# EAGLE schematic InverterControl (EAGLE 9.6.2)
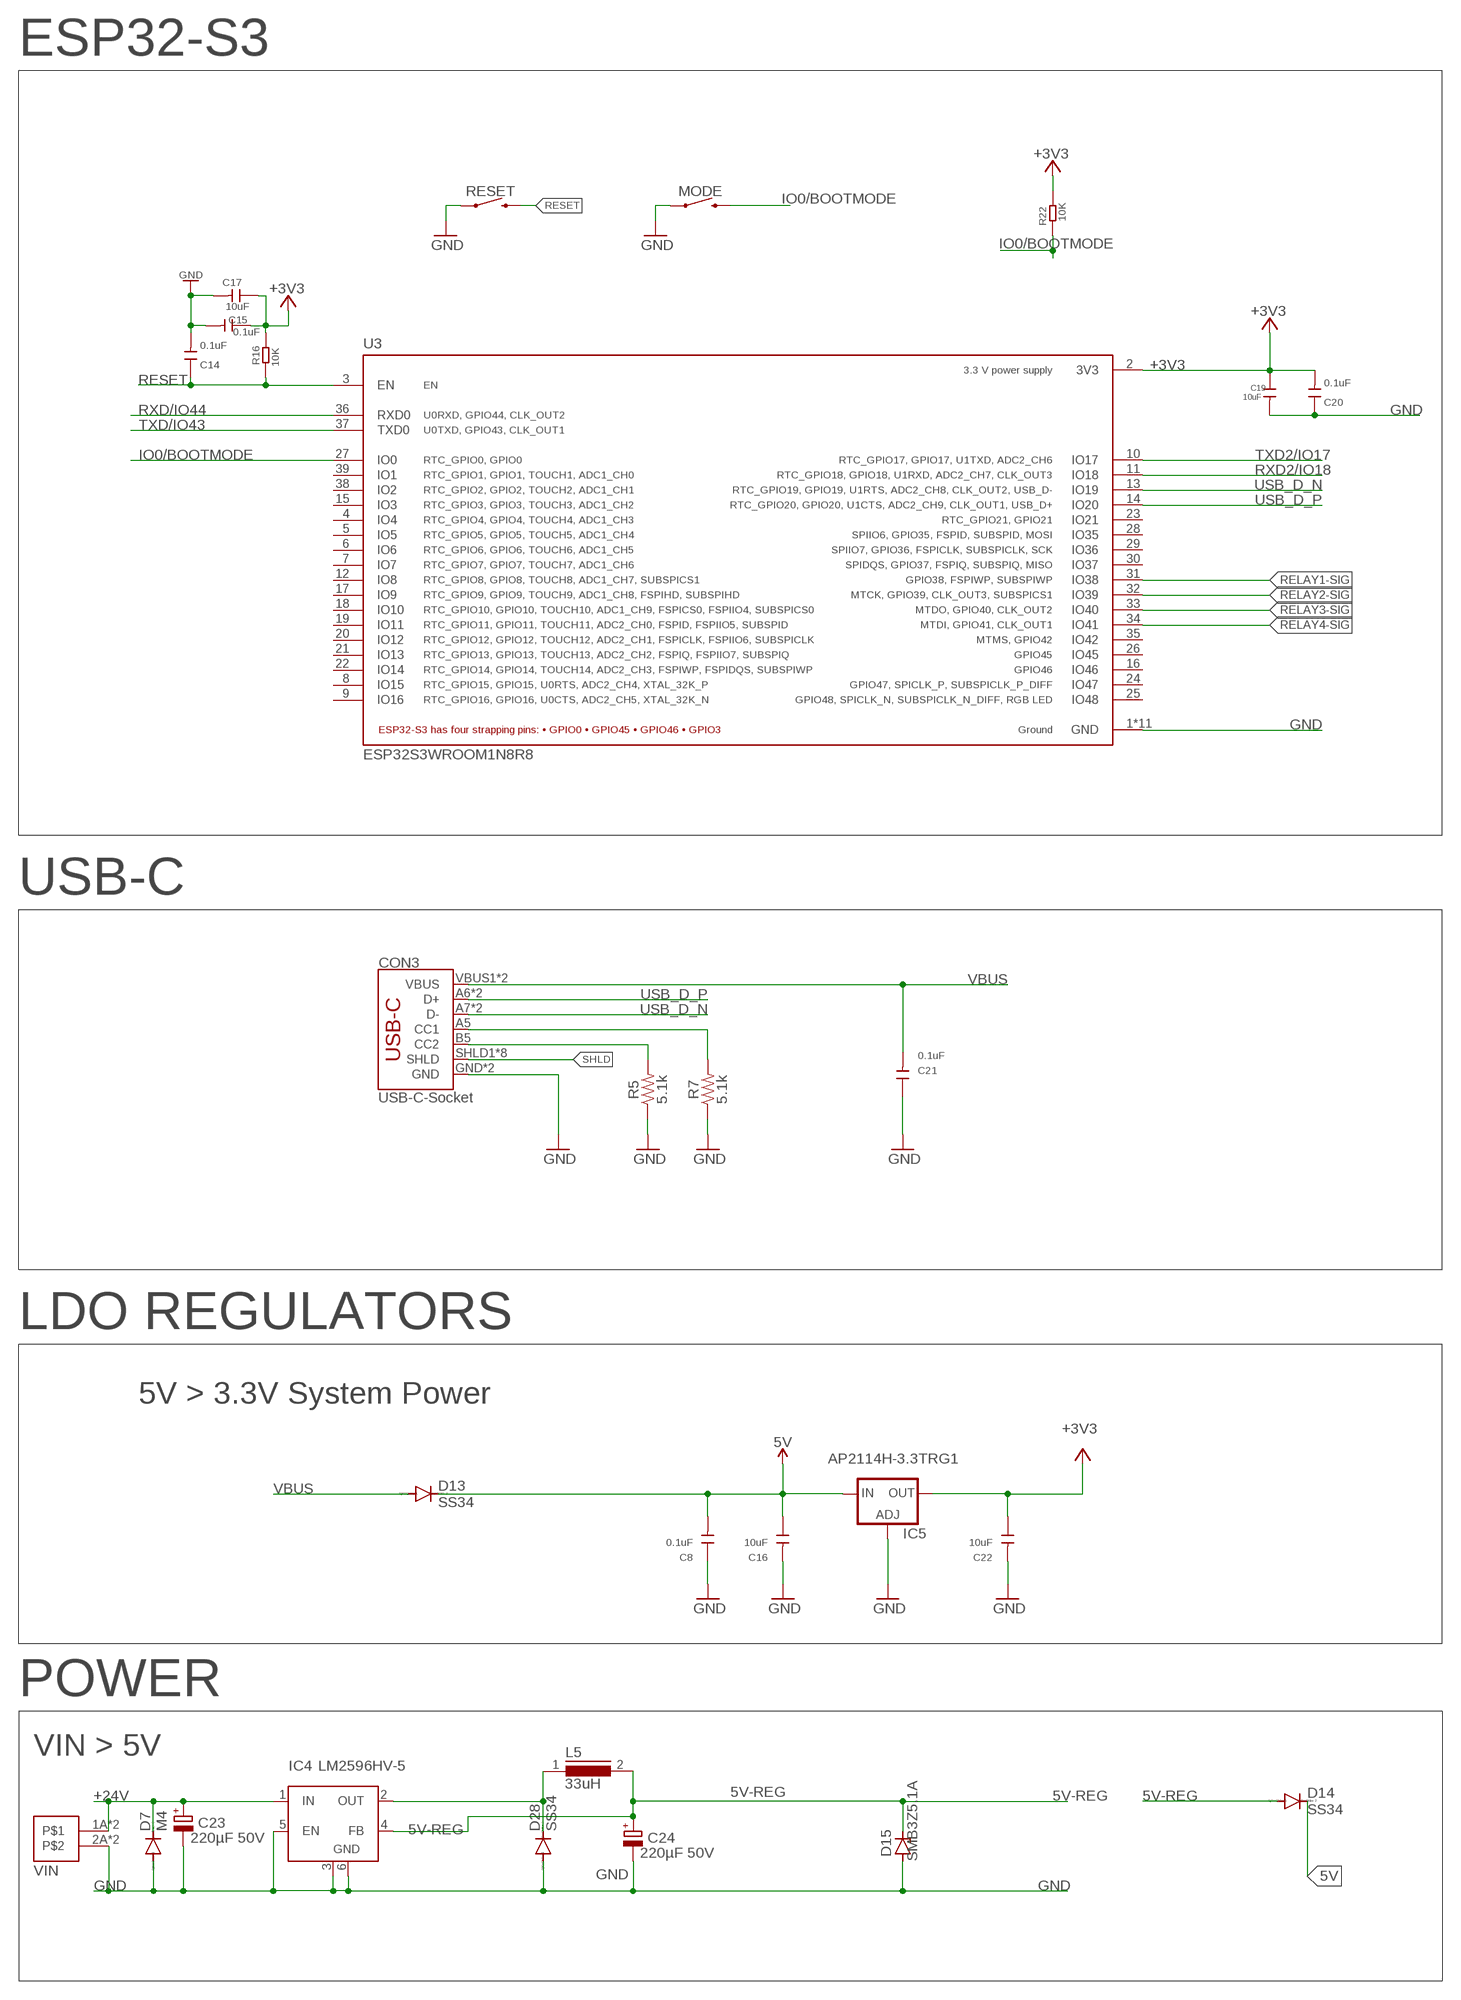
[diagram p0: schematic, sheet 1, part 1 of 2]
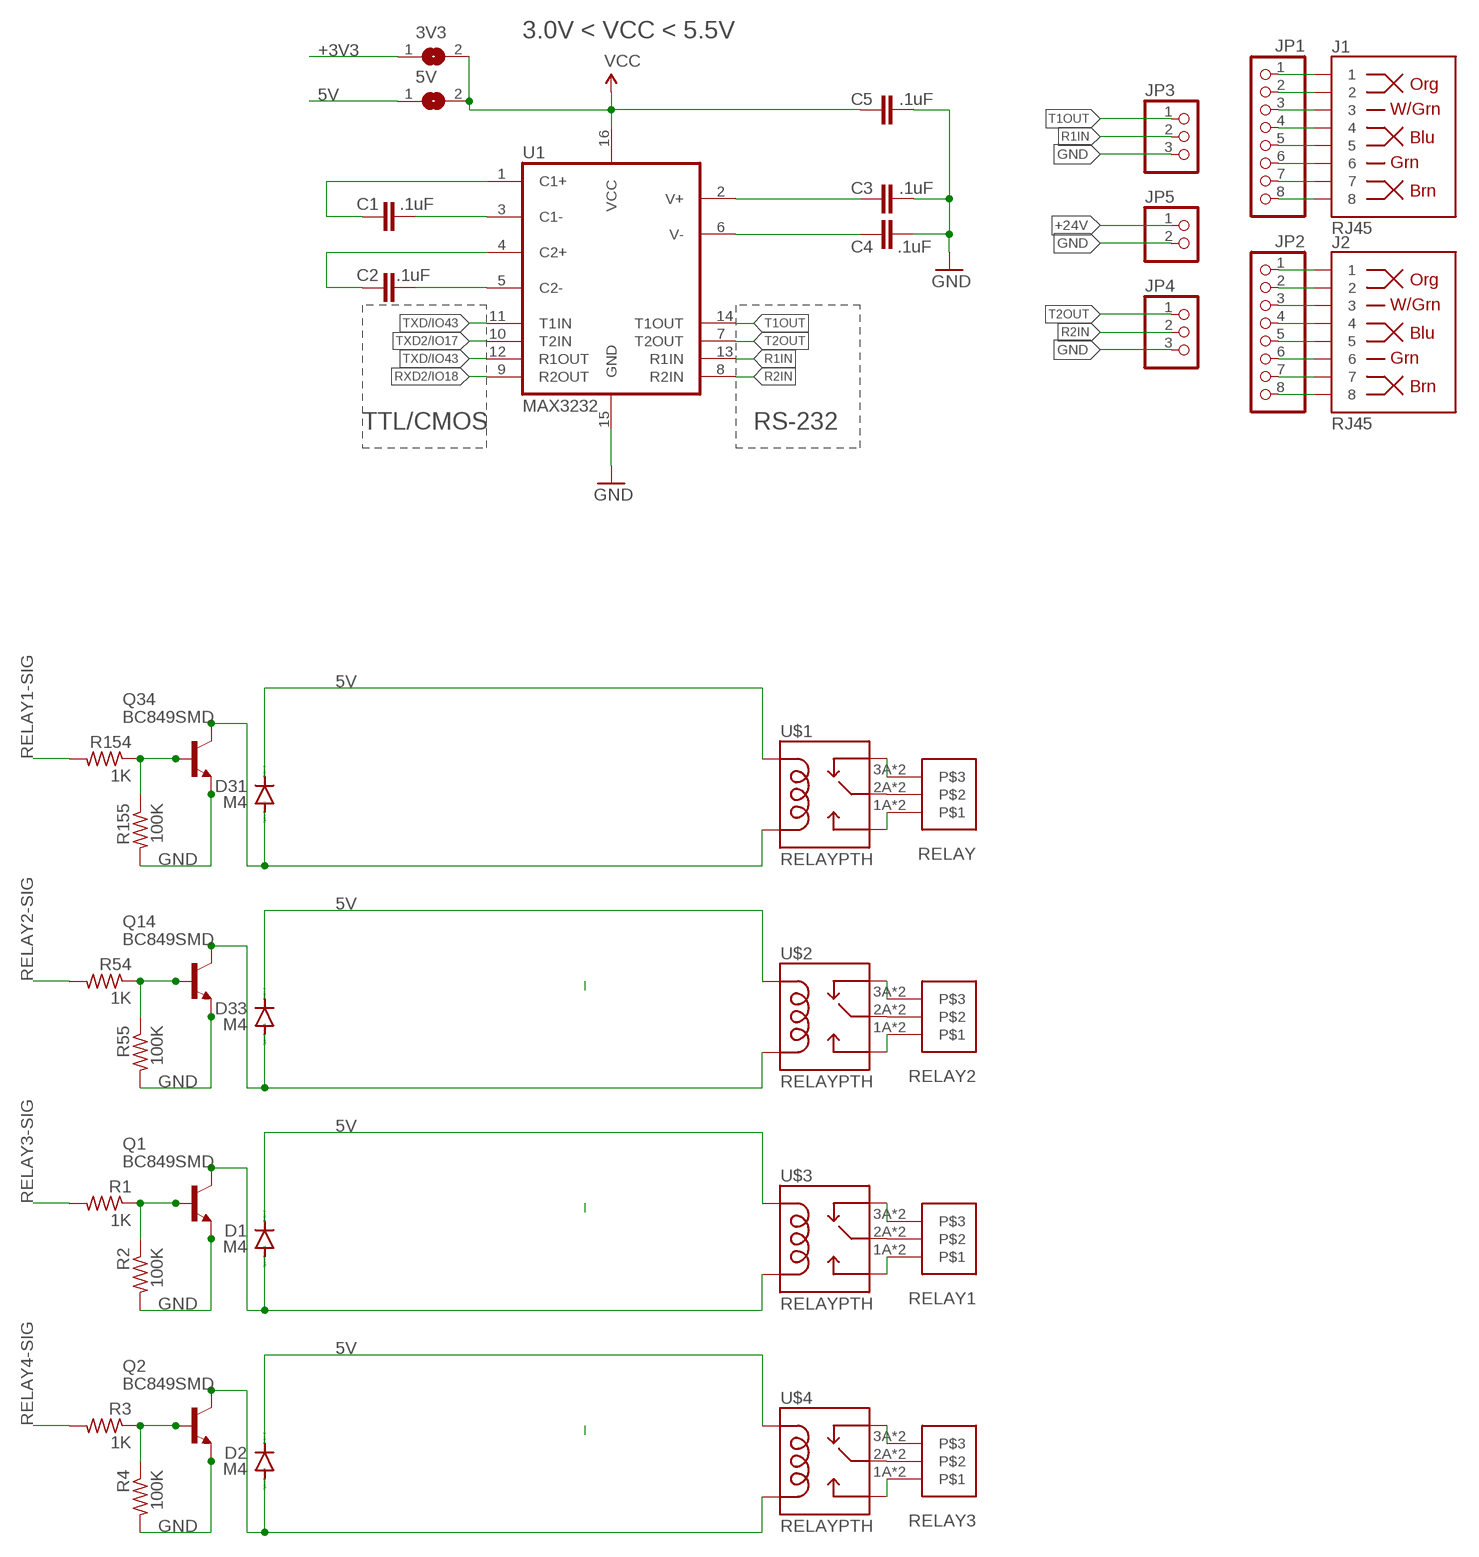
[diagram p1: schematic, sheet 1, part 2 of 2]

## Parts
3V3  SJ  [SJ]
5V  SJ  [SJ]
C1  .1uF  0.1UF-25V(+80/-20%)(0603)  [0603-CAP]
C2  .1uF  0.1UF-25V(+80/-20%)(0603)  [0603-CAP]
C3  .1uF  0.1UF-25V(+80/-20%)(0603)  [0603-CAP]
C4  .1uF  0.1UF-25V(+80/-20%)(0603)  [0603-CAP]
C5  .1uF  0.1UF-25V(+80/-20%)(0603)  [0603-CAP]
C8  0.1uF  DISCRETE_C-1206  [DISCRETE_C1206]
C14  0.1uF  DISCRETE_C-1206  [DISCRETE_C1206]
C15  0.1uF  DISCRETE_C-1206  [DISCRETE_C1206]
C16  10uF  C-1206  [C1206]
C17  10uF  DISCRETE_C-1206  [DISCRETE_C1206]
C19  10uF  C-1206  [C1206]
C20  0.1uF  DISCRETE_C-1206  [DISCRETE_C1206]
C21  0.1uF  DISCRETE_C-1206  [DISCRETE_C1206]
C22  10uF  C-1206  [C1206]
C23  220µF 50V  CPOL-EUE  [PANASONIC_E]
C24  220µF 50V  CPOL-EUE  [PANASONIC_E]
CON3  USB-C-Socket  USB_C16PIN  [USB-C-16P]
D1  M4  DIODE-DO-214AC  [DO-214AC]
D2  M4  DIODE-DO-214AC  [DO-214AC]
D7  M4  DIODE-DO-214AC  [DO-214AC]
D13  SS34  DIODE-DO-214AC  [DO-214AC]
D14  SS34  DIODE-SMB  [SMB]
D15  SMB3Z5.1A  ZENER-DIODESMB  [SMB]
D28  SS34  DIODE-SMB  [SMB]
D31  M4  DIODE-DO-214AC  [DO-214AC]
D33  M4  DIODE-DO-214AC  [DO-214AC]
IC4  LM2596HV-5  LM2596S  [TO263-5]
IC5  AP2114H-3.3TRG1  LD117AS33TR  [SOT223]
J1  RJ45  RJ45-8  [RJ45-8]
J2  RJ45  RJ45-8  [RJ45-8]
JP1  PINHD-1X8  [1X08]
JP2  PINHD-1X8  [1X08]
JP3  PINHD-1X3  [1X03]
JP4  PINHD-1X3  [1X03]
JP5  PINHD-1X2  [1X02]
L5  33uH  DR127  [DR127]
MODE  MOMENTARY-SWITCH-SPST-PTH-6.0MM  [TACTILE_SWITCH_PTH_6.0MM]
Q1  BC849SMD  [SOT23-BEC]
Q2  BC849SMD  [SOT23-BEC]
Q14  BC849SMD  [SOT23-BEC]
Q34  BC849SMD  [SOT23-BEC]
R1  1K  R-US_R1206  [R1206]
R2  100K  R-US_R1206  [R1206]
R3  1K  R-US_R1206  [R1206]
R4  100K  R-US_R1206  [R1206]
R5  5.1k  5.1KOHM5.1KOHM-0603-1/10W-1%  [0603@1]
R7  5.1k  5.1KOHM5.1KOHM-0603-1/10W-1%  [0603@1]
R16  10K  R-1206  [R1206]
R22  10K  R-1206  [R1206]
R54  1K  R-US_R1206  [R1206]
R55  100K  R-US_R1206  [R1206]
R154  1K  R-US_R1206  [R1206]
R155  100K  R-US_R1206  [R1206]
RELAY  WJ212R-THR-3.5-3  [WJ212R-THR-3.5-3]
RELAY1  WJ212R-THR-3.5-3  [WJ212R-THR-3.5-3]
RELAY2  WJ212R-THR-3.5-3  [WJ212R-THR-3.5-3]
RELAY3  WJ212R-THR-3.5-3  [WJ212R-THR-3.5-3]
RESET  MOMENTARY-SWITCH-SPST-PTH-6.0MM  [TACTILE_SWITCH_PTH_6.0MM]
U1  MAX3232  MAX232SOIC16  [SO016]
U3  ESP32S3WROOM1N8R8  [XCVR_ESP32S3WROOM1N8R8]
U$1  RELAYPTH  [SRD-05VDC-SL-C]
U$2  RELAYPTH  [SRD-05VDC-SL-C]
U$3  RELAYPTH  [SRD-05VDC-SL-C]
U$4  RELAYPTH  [SRD-05VDC-SL-C]
VIN  WJ212R-THR-3.5-2  [WJ212R-THR-3.5-2]

## Nets
5V: 5V.1 C8.2 C16.1 D1.C D2.C D13.C D14.C D31.C D33.C IC5.3(IN) U$1.COIL1 U$2.COIL1 U$3.COIL1 U$4.COIL1
5V-REG: C24.+ D14.A D15.C IC4.4(FB) L5.2
+3V3: 3V3.1 C15.1 C17.1 C19.1 C20.2 C22.1 IC5.4(OUT) R16.2 R22.2 U3.2(3V3)
+24V: C23.+ D7.C IC4.1(IN) JP5.1 VIN.1A VIN.1B
C1+: C1.1 U1.1(C1+)
C1-: C1.2 U1.3(C1-)
C2+: C2.1 U1.4(C2+)
C2-: C2.2 U1.5(C2-)
CC1: CON3.A5(CC1) R7.2
CC2: CON3.B5(CC2) R5.2
COIL-1: D31.A Q34.C U$1.COIL0
COIL-2: D33.A Q14.C U$2.COIL0
COIL-3: D1.A Q1.C U$3.COIL0
COIL-4: D2.A Q2.C U$4.COIL0
GND: C3.2 C4.2 C5.2 C8.1 C14.2 C15.2 C16.2 C17.2 C19.2 C20.1 C21.1 C22.2 C23.- C24.- CON3.GND CON3.GND2(GND) D7.A D15.A D28.A IC4.3(GND) IC4.5(EN) IC4.6(GND) IC5.1(ADJ) JP3.3 JP4.3 JP5.2 MODE.1 Q1.E Q2.E Q14.E Q34.E R2.2 R4.2 R5.1 R7.1 R55.2 R155.2 RESET.1 U1.15(GND) U3.1(GND) U3.40(GND) U3.41_1(GND) U3.41_2(GND) U3.41_3(GND) U3.41_4(GND) U3.41_5(GND) U3.41_6(GND) U3.41_7(GND) U3.41_8(GND) U3.41_9(GND) VIN.2A VIN.2B
IO0/BOOTMODE: MODE.3 R22.1 U3.27(IO0)
N$1: J1.1 JP1.1
N$2: J1.2 JP1.2
N$3: J1.3 JP1.3
N$4: J1.4 JP1.4
N$5: J1.5 JP1.5
N$6: J1.6 JP1.6
N$7: J1.7 JP1.7
N$8: J1.8 JP1.8
N$9: J2.1 JP2.1
N$10: J2.2 JP2.2
N$11: J2.3 JP2.3
N$12: J2.4 JP2.4
N$13: J2.5 JP2.5
N$14: J2.6 JP2.6
N$15: J2.7 JP2.7
N$16: J2.8 JP2.8
N$18: RELAY.2A RELAY.2B U$1.SWCOMMON
N$19: RELAY2.2A RELAY2.2B U$2.SWCOMMON
N$20: Q1.B R1.1 R2.1
N$22: RELAY1.2A RELAY1.2B U$3.SWCOMMON
N$23: Q2.B R3.1 R4.1
N$25: RELAY3.2A RELAY3.2B U$4.SWCOMMON
N$26: RELAY.3A RELAY.3B U$1.SWCLOSED(SWCLOSE)
N$27: RELAY.1A RELAY.1B U$1.SWOPEN
N$28: RELAY2.3A RELAY2.3B U$2.SWCLOSED(SWCLOSE)
N$29: RELAY2.1A RELAY2.1B U$2.SWOPEN
N$30: RELAY1.3A RELAY1.3B U$3.SWCLOSED(SWCLOSE)
N$31: RELAY1.1A RELAY1.1B U$3.SWOPEN
N$32: Q14.B R54.1 R55.1
N$33: RELAY3.3A RELAY3.3B U$4.SWCLOSED(SWCLOSE)
N$34: RELAY3.1A RELAY3.1B U$4.SWOPEN
N$78: Q34.B R154.1 R155.1
N$164: D28.C IC4.2(OUT) L5.1
R1IN: JP3.2 U1.13(R1IN)
R2IN: JP4.2 U1.8(R2IN)
RELAY1-SIG: R154.2 U3.31(IO38)
RELAY2-SIG: R54.2 U3.32(IO39)
RELAY3-SIG: R1.2 U3.33(IO40)
RELAY4-SIG: R3.2 U3.34(IO41)
RESET: C14.1 R16.1 RESET.3 U3.3(EN)
RXD2/IO18: U1.9(R2OUT) U3.11(IO18)
RXD/IO44: U3.36(RXD0)
SHLD: CON3.SHLD1(SHLD) CON3.SHLD2(SHLD) CON3.SHLD3(SHLD) CON3.SHLD4(SHLD) CON3.SHLD5(SHLD) CON3.SHLD6(SHLD) CON3.SHLD7(SHLD) CON3.SHLD8(SHLD)
T1OUT: JP3.1 U1.14(T1OUT)
T2OUT: JP4.1 U1.7(T2OUT)
TXD2/IO17: U1.10(T2IN) U3.10(IO17)
TXD/IO43: U1.11(T1IN) U1.12(R1OUT) U3.37(TXD0)
USB_D_N: CON3.A7(D-) CON3.B7(D-) U3.13(IO19)
USB_D_P: CON3.A6(D+) CON3.B6(D+) U3.14(IO20)
V+: C3.1 U1.2(V+)
V-: C4.1 U1.6(V-)
VBUS: C21.2 CON3.VBUS1(VBUS) CON3.VBUS2(VBUS) D13.A
VCC: 3V3.2 5V.2 C5.1 U1.16(VCC)
Unconnected: U3.4(IO4) U3.5(IO5) U3.6(IO6) U3.7(IO7) U3.8(IO15) U3.9(IO16) U3.12(IO8) U3.15(IO3) U3.16(IO46) U3.17(IO9) U3.18(IO10) U3.19(IO11) U3.20(IO12) U3.21(IO13) U3.22(IO14) U3.23(IO21) U3.24(IO47) U3.25(IO48) U3.26(IO45) U3.28(IO35) U3.29(IO36) U3.30(IO37) U3.35(IO42) U3.38(IO2) U3.39(IO1)

## Notes on the sheet
- ESP32-S3
- 3.0V < VCC < 5.5V
- TTL/CMOS | RS-232
- USB-C
- LDO REGULATORS
- 5V > 3.3V System Power
- POWER
- VIN > 5V

## Library data of the parts
3V3 5V = jumper:SJ: SMD solder JUMPER
C1-C5 = SparkFun-Capacitors:0.1UF-25V(+80/-20%)(0603): CAP-00810 Ceramic Standard decoupling cap; PROD_ID: CAP-00810; SPARKLE_ID: 918; VALUE: 0.1uF
C8 C14 C15 C17 C20 C21 = A9G:DISCRETE_C*: Ceramic Capacitors
C16 C19 C22 = discrete:C*: Ceramic Capacitors
C23 C24 = resistor:CPOL-EU: POLARIZED CAPACITOR, European symbol
CON3 = SparkFun-Connectors:USB_C: USB Type C 16Pin Connector Super Speed pins not available on the 16-pin purely SMD connector so this part is best for USB 2.0 implementations. D1 and D2 are tied together enabling D+/- no matter which way the cable is plugged into the connector. The two channel configuration pins (CC1/2) are exposed. These are normally connected to ground via 5.1k resistors but can be reconfigured for high current/high power applications.; PROD_ID: CONN-14122
D1 D2 D7 D13 D14 D28 D31 D33 = diode:DIODE-: DIODE
D15 = diode:ZENER-DIODE: Z-Diode
IC4 = linear:LM2596S: STEP-DOWN VOLTAGE REGULATOR
IC5 = v-reg:LD117A?*: Low drop fixed and adjustable positive voltage regulators 1 A Source: http://www.st.com/stonline/products/literature/ds/7194/ld1117axx.pdf
J1 J2 = SparkFun-Connectors:RJ45-8: RJ45 Jack - 8 pin Simple RJ45, 8-pin connection. Commonly used for Cat5, Cat5e, and Cat6 Ethernet cables. Here is the connector we sell at SparkFun: RJ45 8-Pin Connector <https://www.sparkfun.com/products/643> (PRT-00643) Datasheet <https://cdn.sparkfun.com/datasheets/Prototyping/04908.pdf> It is used on this SparkFun product: SparkFun RJ45 Breakout <https://www.sparkfun.com/products/716> (BOB-00716) Note, you may also be interested in the "MAGJACK" version of this. It is basically a RJ45 connector, but also has some status LEDs built into the connector housing. You can check that out in this library at the device named "MAGJACK.dev" and see these products online: RJ45 Ethernet MagJack-Compatible <https://www.sparkfun.com/products/8534> (PRT-08534) SparkFun RJ45 MagJack Breakout <https://www.sparkfun.com/products/13021> (BOB-13021); PROD_ID: CONN-08506; SF_ID: PRT-00643
JP1 JP2 = pinhead:PINHD-1X8: PIN HEADER
JP3 JP4 = pinhead:PINHD-1X3: PIN HEADER
JP5 = pinhead:PINHD-1X2: PIN HEADER
L5 = inductors:DR127: High Power Density, High Efficiency, Shielded Inductors Source: coiltronics_dr_series.pdf; SPICEPREFIX: L
MODE RESET = SparkFun-Switches:MOMENTARY-SWITCH-SPST: Momentary Switch (Pushbutton) - SPST Normally-open (NO) SPST momentary switches (buttons, pushbuttons). Variants PTH-12MM - 12mm square, through-hole Momentary Pushbutton Switch - 12mm Square <https://www.sparkfun.com/products/9190> (COM-09190) PTH-6.0MM, PTH-6.0MM-KIT - 6.0mm square, through-hole Mini Pushbutton Switch <https://www.sparkfun.com/products/97> (COM-00097) KIT package intended for soldering kit's - only one side of pads' copper is exposed. PTH-RIGHT-ANGLE-KIT - Right-angle, through-hole Right Angle Tactile Button <https://www.sparkfun.com/products/10791> - Used on SparkFun BigTime Watch Kit <https://www.sparkfun.com/products/11734> SMD-12MM - 12mm square, surface-mount Tactile Button - SMD (12mm) <https://www.sparkfun.com/products/12993> (COM-12993) Used on SparkFun PicoBoard <https://www.sparkfun.com/products/11888> SMD-4.5MM - 4.5mm Square Trackball Switch Used on SparkFun Blackberry Trackballer Breakout <https://www.sparkfun.com/products/13169> SMD-4.6MMX2.8MM - 4.60mm x 2.80mm, surface mount Used on SparkFun SAMD21 Mini Breakout <https://www.sparkfun.com/products/13664> SMD-5.2MM, SMD-5.2-REDUNDANT - 5.2mm square, surface-mount Mini Pushbutton Switch - SMD <https://www.sparkfun.com/products/8720> (COM-08720) Used on Arduino Pro Mini <https://www.sparkfun.com/products/11114> REDUNDANT package connects both switch circuits together SMD-6.0X3.5MM - 6.0 x 3.5mm, surface mount Momentary Reset Switch SMD <https://www.sparkfun.com/products/8229> (COM-08229) SMD-6.2MM-TALL - 6.2mm square, surface mount Tactile Button - SMD (6mm) <https://www.sparkfun.com/products/12992> Used on SparkFun Digital Sandbox <https://www.sparkfun.com/products/12651> SMD-RIGHT-ANGLE - Right-angle, surface mount Used on SparkFun Block for Intel® Edison - Arduino <https://www.sparkfun.com/products/13036>; PROD_ID: SWCH-08441; SF_SKU: COM-00097
Q1 Q2 Q14 Q34 = transistor-npn:BC849*: NPN Transistor
R1-R4 R54 R55 R154 R155 = adafruit:R-US_: RESISTOR, American symbol
R5 R7 = SparkFun-Resistors:5.1KOHM; PROD_ID: RES-12083
R16 R22 = discrete:R*
RELAY RELAY1-RELAY3 = WJ212R-THR-3.5-3.81:WJ212R-THR-3.5-3
U1 = SparkFun-DigitalIC:MAX232: RS232 Transceiver Very common IC. This is generically called 'MAX232', but works with the 3V equivalent MAX3232 generic ICs. Field tested and mother approved. Spark Fun Electronics SKU : COM-00316 (DIP) and COM-00589 (SMD); PROD_ID: IC-08171
U3 = ESP32S3WROOM1N8R8:ESP32S3WROOM1N8R8: Check availability <https://pricing.snapeda.com/parts/ESP32S3WROOM1N8R8/Espressif%20Systems/view-part?ref=eda>; AVAILABILITY: In Stock; DESCRIPTION: Bluetooth, WiFi 802.11b/g/n, Bluetooth v5.0 Transceiver Module 2.4GHz PCB Trace Surface Mount; MF: Espressif Systems; MP: ESP32S3WROOM1N8R8; PACKAGE: None; PRICE: None; PURCHASE-URL: https://pricing.snapeda.com/search/part/ESP32S3WROOM1N8R8/?ref=eda
U$1-U$4 = SRD-05VDC-SL-C:RELAY: SPDT relay (COM-00101)
VIN = WJ212R-THR-3.5-3.81:WJ212R-THR-3.5-2